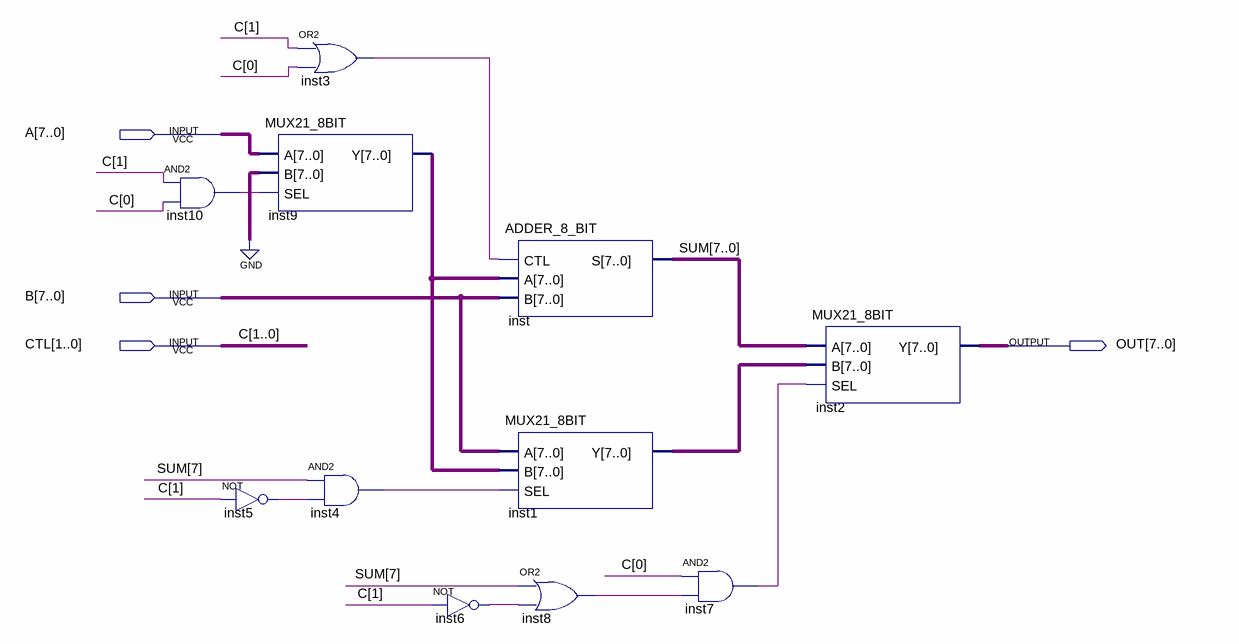
[diagram p0: schematic sheet]
// Quartus schematic ADD_MIN_SUB_ABS.bdf as structural Verilog: 11 symbols, 4 pins
module ADD_MIN_SUB_ABS (
  input  [7:0] A,
  input  [7:0] B,
  input  [1:0] CTL,
  output [7:0] OUT
);

  wire inst3_out, inst4_out, inst5_out, inst6_out, inst7_out, inst8_out, inst10_out;
  wire [7:0] inst1_y, inst9_y, SUM;

  and inst10 (inst10_out, CTL[1], CTL[0]);
  not inst5 (inst5_out, CTL[1]);
  or inst3 (inst3_out, CTL[1], CTL[0]);
  MUX21_8BIT inst9 (.A(A), .B({8{1'b0}}), .SEL(inst10_out), .Y(inst9_y));
  and inst4 (inst4_out, SUM[7], inst5_out);
  not inst6 (inst6_out, CTL[1]);
  ADDER_8_BIT inst (.CTL(inst3_out), .A(inst9_y), .B(B), .S(SUM));
  MUX21_8BIT inst1 (.A(B), .B(inst9_y), .SEL(inst4_out), .Y(inst1_y));
  or inst8 (inst8_out, SUM[7], inst6_out);
  and inst7 (inst7_out, CTL[0], inst8_out);
  MUX21_8BIT inst2 (.A(SUM), .B(inst1_y), .SEL(inst7_out), .Y(OUT));

  // Other names for the same wires on the sheet: C[1:0] = CTL
endmodule
